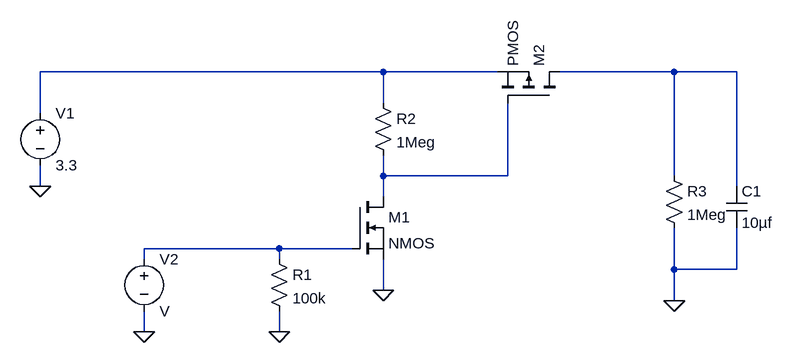
[diagram p0: schematic Draft2.asc]
Draft2.asc, the LTspice schematic file:
Version 4
SHEET 1 928 680
WIRE 272 0 -256 0
WIRE 448 0 272 0
WIRE 720 0 544 0
WIRE 816 0 720 0
WIRE 272 48 272 0
WIRE -256 64 -256 0
WIRE 272 160 272 128
WIRE 464 160 464 48
WIRE 464 160 272 160
WIRE 720 160 720 0
WIRE -256 176 -256 144
WIRE 816 176 816 0
WIRE 272 192 272 160
WIRE 112 272 -96 272
WIRE 224 272 112 272
WIRE -96 288 -96 272
WIRE 112 288 112 272
WIRE 720 304 720 240
WIRE 816 304 816 240
WIRE 816 304 720 304
WIRE 272 336 272 288
WIRE 720 352 720 304
WIRE -96 400 -96 368
WIRE 112 400 112 368
FLAG 272 336 0
FLAG -96 400 0
FLAG -256 176 0
FLAG 112 400 0
FLAG 720 352 0
SYMBOL nmos 224 192 R0
SYMATTR InstName M1
SYMBOL res 96 272 R0
SYMATTR InstName R1
SYMATTR Value 100k
SYMBOL pmos 544 48 M270
SYMATTR InstName M2
SYMBOL voltage -256 48 R0
WINDOW 123 0 0 Left 0
WINDOW 39 0 0 Left 0
SYMATTR InstName V1
SYMATTR Value 3.3
SYMBOL voltage -96 272 R0
SYMATTR InstName V2
SYMBOL res 256 32 R0
SYMATTR InstName R2
SYMATTR Value 1Meg
SYMBOL res 704 144 R0
SYMATTR InstName R3
SYMATTR Value 1Meg
SYMBOL cap 800 176 R0
SYMATTR InstName C1
SYMATTR Value 10µf

The netlist it stands for:
* Draft2.asc
M1 N003 N004 0 0 NMOS
R1 N004 0 100k
M2 N002 N003 N001 N001 PMOS
V1 N001 0 3.3
V2 N004 0 V
R2 N001 N003 1Meg
R3 N002 0 1Meg
C1 N002 0 10µf
.model NMOS NMOS
.model PMOS PMOS
.lib standard.mos
.backanno
.end